# EAGLE design NancyHacker (EAGLE 6.4)
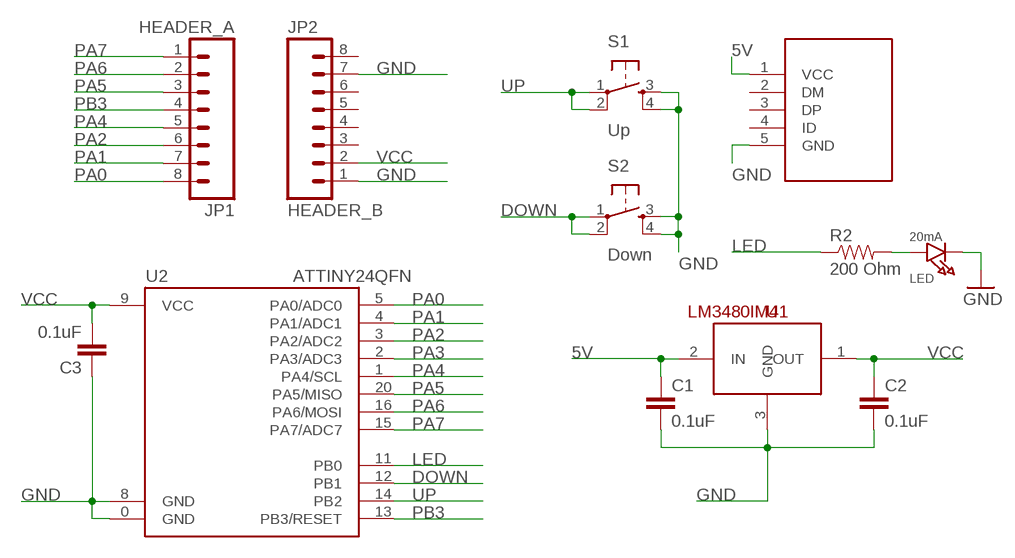
[diagram p0: schematic, sheet 1]

## Parts
C1  0.1uF  CAP0603-CAP  [0603-CAP]
C2  0.1uF  CAP0603-CAP  [0603-CAP]
C3  0.1uF  CAP0603-CAP  [0603-CAP]
JP1  HEADER_A  M081X08  [1X08]
JP2  HEADER_B  M081X08  [1X08]
LED  20mA  LED0603_NOOUTLINE  [CHIPLED_0603_NOOUTLINE]
R2  200 Ohm  RESISTOR0402-RES  [0402-RES]
S1  Up  TAC_SWITCHSMD  [TACTILE_SWITCH_SMD]
S2  Down  TAC_SWITCHSMD  [TACTILE_SWITCH_SMD]
U1  LM3480IM4  [SOT23-3]
U2  ATTINY24QFN  [QFN20]
U$1  USB-MICROB-SMDRECEPT  [USB-MICROB-RECEPT]

## Nets
5V: C1.1 U1.2(IN) U$1.1(VCC)
DOWN: S2.1 S2.2 U2.12(PB1)
GND: C1.2 C2.2 C3.1 JP2.1 JP2.7 LED.C S1.3 S1.4 S2.3 S2.4 U1.3(GND) U2.0(GND) U2.8(GND) U$1.5(GND)
LED: R2.1 U2.11(PB0)
PA0: JP1.8 U2.5(PA0/ADC0)
PA1: JP1.7 U2.4(PA1/ADC1)
PA2: JP1.6 U2.3(PA2/ADC2)
PA3: U2.2(PA3/ADC3)
PA4: JP1.5 U2.1(PA4/SCL)
PA5: JP1.3 U2.20(PA5/MISO)
PA6: JP1.2 U2.16(PA6/MOSI)
PA7: JP1.1 U2.15(PA7/ADC7)
PB3: JP1.4 U2.13(PB3/RESET)
STATUS_LED_RESISTOR: LED.A R2.2
UP: S1.1 S1.2 U2.14(PB2)
VCC: C2.1 C3.2 JP2.2 U1.1(OUT) U2.9(VCC)
Unconnected: JP2.3 JP2.4 JP2.5 JP2.6 JP2.8 U$1.2(DM) U$1.3(DP) U$1.4(ID)

## Library data of the parts
C1-C3 = SparkFun-Capacitors:CAP: Capacitor Standard 0603 ceramic capacitor, and 0.1" leaded capacitor.
JP1 JP2 = SparkFun-Connectors:M08: Header 8 Standard 8-pin 0.1" header. Use with straight break away headers (SKU : PRT-00116), right angle break away headers (PRT-00553), swiss pins (PRT-00743), machine pins (PRT-00117), and female headers (PRT-00115).
LED = microbuilder:LED: LED 0603 - 0603 Surface Mount Package 2mA: Green LED - Low Power (3.9mcd, 2ma, 1.7Vf) - Digikey: 475-2709-2-ND Orange LED - Low Power (9.8mcd, 2ma, 1.8Vf) - Digikey: 475-1194-2-ND Red LED - Low Power (5mcd, 2ma, 1.8Vf) - Digikey: 475-1195-2-ND Yellow LED - Low Power (7mcd, 2ma, 1.8Vf) - Digikey: 475-1196-2-ND 5mA: Blue LED - Low Power (17mcd, 5ma, 2.9Vf) - Digikey: LNJ937W8CRACT-ND 0805 - 0805 Surface Mount Package 2mA: Red LED (8.8mcd, 2mA, 1.8Vf, Clear) - Low Power [Digikey: 475-2510-1-ND] Green LED (5mcd, 2mA, 1.8Vf, Clear) - Low Power [Digikey: 475-2730-1-ND] Yellow LED (11.3mcd, 2mA, 1.8Vf, Clear) - Low Power [Digikey: 475-2555-1-ND] 20mA: Red LED (104mcd, 20mA, Diffused) - LS R976 [Digikey: 475-1278-6-ND] Red LED (12mcd, 20mA, 2.0Vf, Clear) - APT2012EC [Digikey: 754-1128-1-ND] Green LED (15mcd, 20mA, 2.2Vf, Clear) - APT2012GC [Digikey: 754-1131-1-ND] Orange LED (160mcd, 20mA, 2.1Vf, Clear) - APT2012SECK [Digikey: 754-1130-1-ND] 1206 - 1206 Surface Mount Package Green LED (26mcd, 20mA, Diffused) - LG N971 [Digikey: 475-1407-6-ND] Red LED (15mcd, 20mA, Diffused) - LH N974 [Digikey: 475-1416-6-ND]
R2 = SparkFun-Resistors:RESISTOR: Resistor Basic schematic elements and footprints for 0603, 1206, and PTH resistors.
S1 S2 = SparkFun-Electromechanical:TAC_SWITCH: Momentary Switch Button commonly used for reset or general input. Spark Fun Electronics SKU : COM-00097
U1 = SparkFun-PowerIC:LM3480IM4: Small package linear regulator
U2 = SparkFun-DigitalIC:ATTINY24: Atmel 20-pin 2kB flash uC
U$1 = logxen:USB-MICROB-SMDRECEPT

## Board
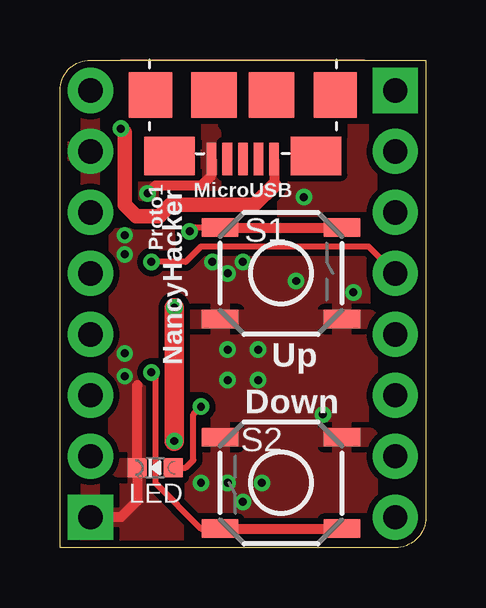
[diagram p1: board, top side]
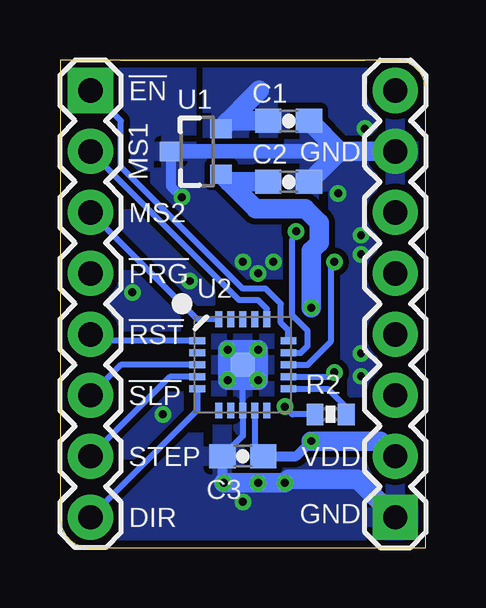
[diagram p2: board, bottom side, seen from below]

Size 15.24 x 20.32 mm. Coordinates in mm from the lower left corner, seen from the top.
Outline: 15.24,1.27 arc-90 13.97,0 0,0 0,19.05 arc-90 1.27,20.32 15.24,20.32 15.24,1.27
Copper layers (1*16): Top 0.0356mm / dielectric 1.5011mm / Bottom 0.0356mm
Design rules "LaenPCBOrder *": minimum track width 6mil, minimum drill 13mil, track to track 6mil, track to pad 6mil, pad to pad 6mil, via to via 6mil, smd to smd 6mil, copper to edge 12mil, drill to drill 6mil, minimum pad ring 7mil, minimum via ring 7mil, stop-mask expansion 4mil, vias tented up to drill 13mil, thermal gap 10mil

### Footprints (pad centres in the part's own frame; a part is rotated, then mirrored left to right if it is on the bottom)
0603-CAP = smd 1.1 x 1: 1 -0.85,0; 2 0.85,0
1X08 = drill 1.016 pad 1.88 square: 1 0,0 | drill 1.016 pad 1.88: 2 2.54,0; 3 5.08,0; 4 7.62,0; 5 10.16,0; 6 12.7,0; 7 15.24,0; 8 17.78,0
CHIPLED_0603_NOOUTLINE = smd 0.8 x 0.8: A 0,-0.75; C 0,0.75
0402-RES = smd 0.7 x 0.9: 1 -0.65,0; 2 0.65,0
TACTILE_SWITCH_SMD = smd 1.524 x 0.762: 1 -2.54,1.905; 2 2.54,1.905; 3 -2.54,-1.905; 4 2.54,-1.905
SOT23-3 = smd 0.8 x 0.9: 1 -0.95,-1; 2 0.95,-1; 3 0,1.1
QFN20 = smd 1 x 1: 0 0,0 | smd 0.65 x 0.3: 1 -1.9,1; 2 -1.9,0.5; 3 -1.9,0; 4 -1.9,-0.5; 5 -1.9,-1; 11 1.9,-1; 12 1.9,-0.5; 13 1.9,0; 14 1.9,0.5; 15 1.9,1 | smd 0.3 x 0.65: 6 -1,-1.9; 7 -0.5,-1.9; 8 0,-1.9; 9 0.5,-1.9; 10 1,-1.9; 16 1,1.9; 17 0.5,1.9; 18 0,1.9; 19 -0.5,1.9; 20 -1,1.9
USB-MICROB-RECEPT = smd 0.4 x 1.35: 1 -1.3,4.125; 2 -0.65,4.125; 3 0,4.125; 4 0.65,4.125; 5 1.3,4.125 | smd 2.1 x 1.6: P$1 3.05,4; P$2 -3.05,4 | smd 1.8 x 1.9: P$3 -3.85,1.45; P$4 3.85,1.45 | smd 1.9 x 1.9: P$5 -1.2,1.45; P$6 1.2,1.45

### Placement (x,y rotation side)
C1  5.71,17.78 0 bottom
C2  5.71,15.24 0 bottom
C3  7.62,3.81 0 bottom
JP1  13.97,19.05 270 bottom
JP2  1.27,1.27 90 bottom
LED  3.97,3.33 90 top
R2  3.97,5.56 180 bottom
S1  9.21,11.43 0 top
S2  9.21,2.7 180 top
U1  9.53,16.51 90 bottom
U2  7.62,7.62 0 bottom
U$1  7.62,20.32 180 top

### Tracks (layer width: path | path; a pad name or v marks a point on that pad's centre or on a via)
5V  (via drill 0.33)
  Top 0.406: U$1.1 8.92,15.11
  Top 0.61: 8.92,15.11 8.1,14.29 4.6,14.29 4.13,13.81 3.17,13.81 2.7,14.29 2.7,17.3 v2.54,17.46
  Bottom 0.813: 6.93,19.05 U1.2 8.21,17.78 C1.1
  pour Bottom (isolate 0.254): 8.89,21.59 -1.27,21.59 -1.27,17.14 8.89,17.14
DOWN  (via drill 0.33)
  Top 0.254: v3.81,7.3 3.97,7.14 3.97,2.7 5.87,0.79 S2.2
  Top 0.406: S2.2 S2.1
  Bottom 0.254: U2.12 3.99,7.12 v3.81,7.3
GND  (via drill 0.33)
  Top 0.406: U$1.5 6.32,15.53 5.87,15.08 3.97,15.08 v3.65,14.76 | 3.22,6.78 LED.C 3.22,1.95 2.54,1.27 JP2.1
  Bottom 0.254: C3.1 7.62,4.66 U2.8 U2.0
  Bottom 0.406: U1.3 10.62,15.07 v10.16,14.61 | C3.1 8.47,2.75 v8.41,2.7
  Bottom 0.61: U1.3 3.81,16.51
  Bottom 0.813: 3.6,16.51 C1.2 | JP2.7 3.6,16.51 | 3.6,16.51 3.7,16.4 | 3.7,16.4 C2.2 | 3.81,16.51 3.7,16.4 | v8.26,8.26 U2.0 | v6.99,8.26 U2.0 | v6.99,6.99 U2.0 | v8.26,6.99 U2.0 | v8.26,8.26 v8.26,6.99 | v8.26,6.99 v6.99,6.99 | v6.99,6.99 v6.99,8.26 | v6.99,8.26 v8.26,8.26 | JP2.1 2.86,2.86 5.71,2.86 v5.87,2.7 v8.41,2.7
  other vias: 6.99,11.43 7.62,11.91 7.62,1.91 6.35,11.91 6.99,2.7 2.7,7.14 9.84,11.11 12.22,10.64 10.95,5.56 2.7,13.02 2.7,12.22 2.7,8.1
  pour Top (isolate 0.254): 16.51,21.59 -1.27,21.59 -1.27,-1.27 16.51,-1.27
  pour Bottom (isolate 0.254, rank 6): 16.51,21.59 -1.27,21.59 -1.27,-1.27 16.51,-1.27
LED
  Bottom 0.254: U2.11 4.08,6.62 3.32,5.86 R2.1
PA0
  Bottom 0.254: U2.5 9.52,5.72 JP1.8
PA1
  Bottom 0.254: U2.4 10.66,7.12 JP1.7
PA2
  Bottom 0.254: U2.3 12.7,7.62 JP1.6
PA4
  Bottom 0.254: U2.1 13.7,8.62 JP1.5
PA5
  Bottom 0.254: U2.20 9.52,9.52 JP1.3
PA6
  Bottom 0.254: U2.16 6.62,9.95 6.99,10.32 7.78,10.32 JP1.2
PA7
  Bottom 0.254: U2.15 5.72,9.05 6.03,9.37 6.03,10.16 6.67,10.79 7.62,10.79 12.7,15.88 12.7,17.78 JP1.1
PB3  (via drill 0.33)
  Top 0.254: JP1.4 12.86,12.54 5.87,12.54 5.24,11.91 v3.81,11.91
  Bottom 0.254: U2.13 4.92,7.62 3.97,8.57 3.97,11.75 v3.81,11.91
STATUS_LED_RESISTOR  (via drill 0.33)
  Top 0.254: LED.A 5.24,3.33 5.56,3.65 5.56,5.56 v5.87,5.87
  Bottom 0.254: R2.2 5.56,5.56 v5.87,5.87
UP  (via drill 0.33)
  Top 0.254: S1.1 5.56,13.34 v5.4,13.18
  Top 0.406: S1.1 S1.2
  Bottom 0.254: U2.14 5.21,8.12 4.92,8.41 4.92,9.05 5.56,9.68 5.56,12.86 5.4,13.02 v5.4,13.18
VCC  (via drill 0.33)
  Top 0.813: v4.76,10 v4.76,4.45
  Bottom 0.254: U2.9 7.12,4.16 C3.2
  Bottom 0.406: C3.2 5.4,3.81 v4.76,4.45
  Bottom 0.813: C2.1 8.21,15.24 U1.1 7.09,14.13 5.03,14.13 4.45,13.54 4.45,12.7 4.76,12.38 v4.76,10 | JP2.2 1.91,4.45 v4.76,4.45

### Text on the board
tPlace: MicroUSB
tNames: Proto1 | NancyHacker
bNames: !EN! | GND | MS1 | MS2 | !PRG! | !RST! | !SLP! | VDD | STEP | GND | DIR